# Altium schematic sheet DIOT_EEM_Adapter.SchDoc
size 420 x 297 mm; DocumentNumber: 1; SheetNumber: 1; SheetTotal: 6; EDA_Number: ARTIQ; ModifiedBy: -; Title2: -; DivGrp: ISE; ModifiedDate: -
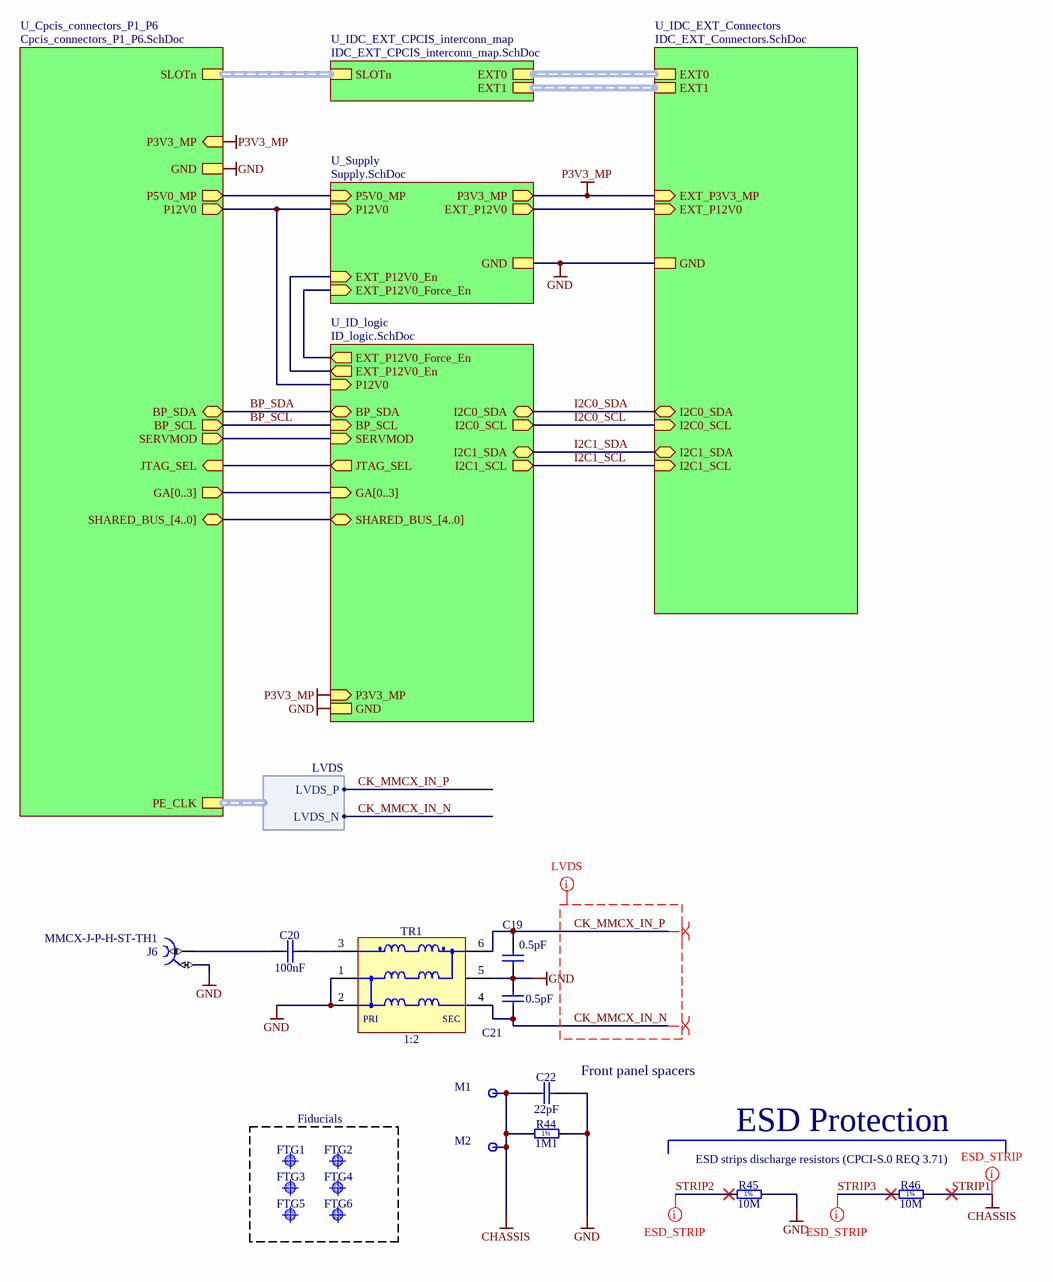
[diagram p0: DIOT_EEM_Adapter.SchDoc]

## Parts
C19  0.5pF  [CAPC1005X50N]
C20  100nF  [CAPC1005X55N]
C21  0.5pF  [CAPC1005X50N]
C22  22pF  [CAPC1005X55N]
FTG1  Use only in PCB  [FIDUCIAL_TOP_S100-200]  (value not drawn)  (no BOM)
FTG2  Use only in PCB  [FIDUCIAL_TOP_S100-200]  (value not drawn)  (no BOM)
FTG3  Use only in PCB  [FIDUCIAL_TOP_S100-200]  (value not drawn)  (no BOM)
FTG4  Use only in PCB  [FIDUCIAL_TOP_S100-200]  (value not drawn)  (no BOM)
FTG5  Use only in PCB  [FIDUCIAL_TOP_S100-200]  (value not drawn)  (no BOM)
FTG6  Use only in PCB  [FIDUCIAL_TOP_S100-200]  (value not drawn)  (no BOM)
J6  MMCX-J-P-H-ST-TH1  [SAMTEC_MMCX-J-P-H-ST-TH1]
M1  Plated Hole  [MTG300_600]  (value not drawn)  (no BOM)
M2  Plated Hole  [MTG300_600]  (value not drawn)  (no BOM)
R44  1M1  [RESC2012X60N]
R45  10M  [RESC2113X55N]
R46  10M  [RESC2113X55N]
TR1  1:2  [XFMR_MINI-CIRCUITS_DB1627]

## Blocks framed on the sheet
Fiducials: FTG1-FTG6

## Sub-sheets
U_Cpcis_connectors_P1_P6 = Cpcis_connectors_P1_P6.SchDoc: SLOTn (harness SLOT), BP_SDA (bidir), BP_SCL (out), SHARED_BUS_[4..0] (bidir), GND, P5V0_MP (out), P12V0 (out), PE_CLK (harness LVDS), GA[0..3] (out), P3V3_MP (in), JTAG_SEL (in), SERVMOD (out)
U_ID_logic = ID_logic.SchDoc: BP_SCL (in), BP_SDA (bidir), I2C0_SDA (bidir), I2C0_SCL (out), I2C1_SDA (bidir), I2C1_SCL (out), GND, P3V3_MP (in), GA[0..3] (in), JTAG_SEL (out), EXT_P12V0_En (out), SERVMOD (in), EXT_P12V0_Force_En (out), P12V0 (in), SHARED_BUS_[4..0] (bidir)
U_IDC_EXT_Connectors = IDC_EXT_Connectors.SchDoc: EXT0 (harness ExtensionConnector), EXT1 (harness ExtensionConnector), I2C0_SDA (bidir), I2C0_SCL (in), I2C1_SDA (bidir), I2C1_SCL (in), EXT_P12V0 (in), EXT_P3V3_MP (in), GND
U_IDC_EXT_CPCIS_interconn_map = IDC_EXT_CPCIS_interconn_map.SchDoc: EXT0 (harness ExtensionConnector), EXT1 (harness ExtensionConnector), SLOTn (harness SLOT)
U_Supply = Supply.SchDoc: EXT_P12V0 (out), P3V3_MP (out), GND, P5V0_MP (in), P12V0 (in), EXT_P12V0_En (in), EXT_P12V0_Force_En (in)

## Harnesses
LVDS: LVDS_P, LVDS_N

## Nets
GND: C19.1 C21.2 C22.2 J6.2 R44.2 R45.2 TR1.1(P1) TR1.2(P1) TR1.5(NC) ; sheet U_ID_logic/GND, sheet U_IDC_EXT_Connectors/GND, sheet U_Cpcis_connectors_P1_P6/GND, sheet U_Supply/GND
P3V3_MP: sheet U_ID_logic/P3V3_MP, sheet U_IDC_EXT_Connectors/EXT_P3V3_MP, sheet U_Cpcis_connectors_P1_P6/P3V3_MP, sheet U_Supply/P3V3_MP
STRIP1: C22.1 M1.1 M2.1 R44.1 R46.2  [also labelled CHASSIS]
BP_SCL: sheet U_ID_logic/BP_SCL, sheet U_Cpcis_connectors_P1_P6/BP_SCL
BP_SDA: sheet U_ID_logic/BP_SDA, sheet U_Cpcis_connectors_P1_P6/BP_SDA
CK_MMCX_IN_N: C21.1 TR1.4(S1) ; sheet U_Cpcis_connectors_P1_P6/PE_CLK.LVDS_N
CK_MMCX_IN_P: C19.2 TR1.6(S1) ; sheet U_Cpcis_connectors_P1_P6/PE_CLK.LVDS_P
I2C0_SCL: sheet U_ID_logic/I2C0_SCL, sheet U_IDC_EXT_Connectors/I2C0_SCL
I2C0_SDA: sheet U_ID_logic/I2C0_SDA, sheet U_IDC_EXT_Connectors/I2C0_SDA
I2C1_SCL: sheet U_ID_logic/I2C1_SCL, sheet U_IDC_EXT_Connectors/I2C1_SCL
I2C1_SDA: sheet U_ID_logic/I2C1_SDA, sheet U_IDC_EXT_Connectors/I2C1_SDA
STRIP2: R45.1
STRIP3: R46.1
NetC20_1: C20.1 J6.1
NetC20_2: C20.2 TR1.3(P1)
(unnamed): sheet U_ID_logic/JTAG_SEL, sheet U_Cpcis_connectors_P1_P6/JTAG_SEL
(unnamed): sheet U_ID_logic/EXT_P12V0_En, sheet U_Supply/EXT_P12V0_En
(unnamed): sheet U_ID_logic/SERVMOD, sheet U_Cpcis_connectors_P1_P6/SERVMOD
(unnamed): sheet U_ID_logic/EXT_P12V0_Force_En, sheet U_Supply/EXT_P12V0_Force_En
(unnamed): sheet U_ID_logic/P12V0, sheet U_Cpcis_connectors_P1_P6/P12V0, sheet U_Supply/P12V0
(unnamed): sheet U_IDC_EXT_Connectors/EXT_P12V0, sheet U_Supply/EXT_P12V0
(unnamed): sheet U_Cpcis_connectors_P1_P6/P5V0_MP, sheet U_Supply/P5V0_MP

## Buses and harness runs
bus sheet U_Cpcis_connectors_P1_P6/GA[0..3] = sheet U_ID_logic/GA[0..3]
bus sheet U_Cpcis_connectors_P1_P6/SHARED_BUS_[4..0] = sheet U_ID_logic/SHARED_BUS_[4..0]
harness sheet U_Cpcis_connectors_P1_P6/SLOTn = sheet U_IDC_EXT_CPCIS_interconn_map/SLOTn
harness sheet U_IDC_EXT_Connectors/EXT0 = sheet U_IDC_EXT_CPCIS_interconn_map/EXT0
harness sheet U_IDC_EXT_Connectors/EXT1 = sheet U_IDC_EXT_CPCIS_interconn_map/EXT1

## Layout directives
differential pair: CK_MMCX_IN_N, CK_MMCX_IN_P
net class LVDS: CK_MMCX_IN_N, CK_MMCX_IN_P
net class ESD_STRIP: STRIP1, STRIP2, STRIP3

## Notes on the sheet
- (near C22) Front panel spacers
- ESD strips discharge resistors (CPCI-S.0 REQ 3.71)
- ESD Protection
- Project/Equipment
- Document
- Designer
- Drawn by
- Check.by
- Copyright WUT 2023.
  This document describes Open Hardware and is licensed under the CERN-OHL-W v2
  You may redistribute and modify this documentation and make products using it under the terms of the CERN-OHL-W v2 (https:/cern.ch/cern-ohl). This documentation is distributed WITHOUT ANY EXPRESS OR IMPLIED WARRANTY, INCLUDING OF MERCHANTABILITY, SATISFACTORY QUALITY AND FITNESS FOR A PARTICULAR PURPOSE. Please see the CERN-OHL-W v2 for applicable conditions.
  Source location: https://github.com/sinara-hw/EEM_FMC_Carrier
  As per CERN-OHL-W v2 section 4, should You produce hardware based on these sources, You must maintain the Source Location visible on the silkscreen or top copper for a EEM FMC Carrier PCB or other product you make using this documentation.
- Contact:
- File
- Last Mod.
- Print Date
- Sheet
- Size
- A3
- of
- Rev
- (in symbol R0805_1M1_1%_0.125W_100PPM) 1%
- (in symbol R0805_10M_1%_0.125W_100PPM_VISHAY_CRCW e3) 1%
- (in symbol XFMR_MINI-CIRCUITS_TCM2-43X+) PRI; SEC

## Library data of the parts
C19 C21 = CC0402_0.5PF_25V_0.05PF_AVX_04023J0R5ABSTR: Non-polarised capacitor; Part Description: Thin-Film Chip Capacitors for RF Signal and Power Applications, Accu-P Series; Manufacturer: AVX; Voltage: 25V; Tolerance: ±0.05pF; Part Number: CC0402_0.5PF_25V_0.05PF_AVX_04023J0R5ABSTR; Component Kind: Standard; Component Type: Standard; Pin Count: 2; Value: 0.5pF; Status: None; Manufacturer Part Number: 04023J0R5ABSTR; Case: 0402; Mounted: Yes; Socket: No; SMD: Yes; Sense: No; ComponentHeight: 0.5mm; HelpURL: \\cern.ch\dfs\Applications\Altium\Datasheets\CC0402_AVX_ACCU-P.pdf; Author: CERN DEM JLC; CreateDate: 2017-02-22; LatestRevisionDate: 2017-02-22
C20 = CC0402_100NF_16V_10%_X7R: Non-polarised capacitor; Part Description: SMD Multilayer Chip Ceramic Capacitor; Manufacturer: GENERIC; Manufacturer1 Part Number: GRM155R71C104KA88D; Voltage: 16V; TC: X7R; Tolerance: ±10%; Part Number: CC0402_100NF_16V_10%_X7R; Component Kind: Standard; Component Type: Standard; Pin Count: 2; Value: 100nF; Status: Not Recommended; Manufacturer Part Number: CC0402_100NF_16V_10%_X7R; Case: 0402; Mounted: Yes; Socket: No; SMD: Yes; Sense: No; Manufacturer1 Example: MURATA; Manufacturer1 ComponentHeight: 0.55mm; HelpURL: \\cern.ch\dfs\Applications\Altium\Datasheets\CC0402_X7R_MURATA_GRM.pdf; Author: CERN DEM JLC; CreateDate: 05.12.2013; LatestRevisionDate: 03.12.2007
C22 = CC0402_22PF_50V_5%_C0G: Non-polarised capacitor; Part Description: SMD Multilayer Chip Ceramic Capacitor; Manufacturer: GENERIC; Manufacturer1 Part Number: C0402C220J5GACTU; Voltage: 50V; TC: C0G/NP0; Tolerance: ±5%; Part Number: CC0402_22PF_50V_5%_C0G; Component Kind: Standard; Component Type: Standard; Pin Count: 2; Value: 22pF; Status: Preferred; Manufacturer Part Number: CC0402_22PF_50V_5%_C0G; Case: 0402; Mounted: Yes; Socket: No; SMD: Yes; Manufacturer1 Example: KEMET; Manufacturer1 ComponentHeight: 0.55mm; HelpURL: \\cern.ch\dfs\Applications\Altium\Datasheets\CC0402_C0G_KEMET_(Commercial Grade).pdf; Author: CERN DEM JLC; CreateDate: 2007-12-03; LatestRevisionDate: 2007-12-03; Sense: No
FTG1-FTG6 = FIDUCIAL_TARGET_S100-200: Fiducial Target; Part Description: Square Fiducial Target, Top Layer, 1.0mm, Top Solder 2.0mm, Keepout =2.0mm; Mounted: No; Part Number: FIDUCIAL_TARGET_S100-200; Component Type: Standard (No BOM); Pin Count: 1; Family: Fiducial; Socket: No; SMD: Yes; Status: None; ComponentHeight: 0mm; Author: CERN DEM JLC; CreateDate: 2010-02-09; LatestRevisionDate: 2012-04-04; PackageDescription: Square Fiducial Target, Top Layer, 1.0mm, Top Solder 2.0mm, Keepout =2.0mm; HelpURL: Undefined; Sense: No
J6 = SAMTEC_MMCX-J-P-H-ST-TH1: Part Description: Straight Through-hole 50 Ohm Micro Mini RF Jack, MMCX Series; Manufacturer: SAMTEC; PressFit: No; Part Number: SAMTEC_MMCX-J-P-H-ST-TH1; Component Kind: Standard; Component Type: Standard; Pin Count: 2; Mounted: Yes; Socket: No; Sense: No; SMD: No; Status: None; Manufacturer Part Number: MMCX-J-P-H-ST-TH1; ComponentHeight: 4.35mm; HelpURL: \\cern.ch\dfs\Applications\Altium\Datasheets\SAMTEC_MMCX-J-P-H-ST-TH1.pdf; Author: CERN DEM JLC; CreateDate: 05.12.2012; LatestRevisionDate: 05.12.2012
M1 M2 = PLATED_HOLE3.0_PAD6.0: Single Terminal Socket; Part Description: Plated Through Hole: Hole Dia.=3.0mm Pad Dia.=6.0mm; Mounted: No; Table: Pads; Part Number: PLATED_HOLE3.0_PAD6.0; Component Type: Standard (No BOM); Designator: Single Terminal Socket; Library Reference: Single Terminal Socket; Pin Count: 1; Family: Plated Hole; Socket: No; SMD: No; Status: None; ComponentHeight: 0mm; Author: CERN DEM JLC; CreateDate: 26.05.2008; LatestRevisionDate: 26.05.2008; PackageDescription: Plated Through Hole: Hole Dia.=3.0mm Pad Dia.=6.0mm
R44 = R0805_1M1_1%_0.125W_100PPM: Resistor - 1%; Part Description: General Purpose Thick Film Chip Resistor; Manufacturer: GENERIC; Manufacturer1 Part Number: NRC10F1104TRF; Power: 0.125W; TC: ±100ppm/°C; PressFit: No; Part Number: R0805_1M1_1%_0.125W_100PPM; Component Kind: Standard; Component Type: Standard; Pin Count: 2; Value: 1M1; Status: Preferred; Tolerance: ±1%; Manufacturer Part Number: R0805_1M1_1%_0.125W_100PPM; Case: 0805; Mounted: Yes; Sense: No; Socket: No; SMD: Yes; Manufacturer1 Example: NIC COMPONENT; Manufacturer1 ComponentHeight: 0.6mm; HelpURL: \\cern.ch\dfs\Applications\Altium\Datasheets\R0805_NIC_NRC.pdf; Author: CERN DEM JLC; CreateDate: 03/12/2007; LatestRevisionDate: 13/03/2008
R45 R46 = R0805_10M_1%_0.125W_100PPM_VISHAY_CRCW e3: Resistor - 1%; Part Description: 150V, Standard Thick Film Chip Resistor; Manufacturer: VISHAY DALE; Manufacturer Part Number: CRCW080510M0FKEA; Power: 0.125W; TC: ±100ppm/°C; PressFit: No; Part Number: R0805_10M_1%_0.125W_100PPM_VISHAY_CRCW e3; Component Kind: Standard; Component Type: Standard; Pin Count: 2; Value: 10M; Status: None; Tolerance: ±1%; Case: 0805; Mounted: Yes; Sense: No; Socket: No; SMD: Yes; ComponentHeight: 0.5mm; HelpURL: \\cern.ch\dfs\Applications\Altium\Datasheets\R0805_VISHAY_CRCW e3.pdf; Author: CERN DEM BC; CreateDate: 2019-11-12; LatestRevisionDate: 2019-11-12
TR1 = XFMR_MINI-CIRCUITS_TCM2-43X+: 50 OHMS 10 to 4000 MHz RF Transformer; Power: 0.4W; Part Number: XFMR_MINI-CIRCUITS_TCM2-43X+; Component Kind: Standard; Component Type: Standard; Pin Count: 6; Value: 1:2; Status: None; Part Description: 50 Ohms 10 to 4000MHz RF Transformer; Manufacturer: MINI-CIRCUITS; Manufacturer Part Number: TCM2-43X+; Mounted: Yes; Socket: No; Sense: No; SMD: Yes; ComponentHeight: 4.06mm; HelpURL: \\cern.ch\dfs\Applications\Altium\Datasheets\XFMR_MINI-CIRCUITS_TCM2-43X+.pdf; Author: CERN DEM BC; CreateDate: 2016-02-12; LatestRevisionDate: 2016-02-12